# EAGLE design IEEE_EXT_Base (EAGLE 9.5.2)
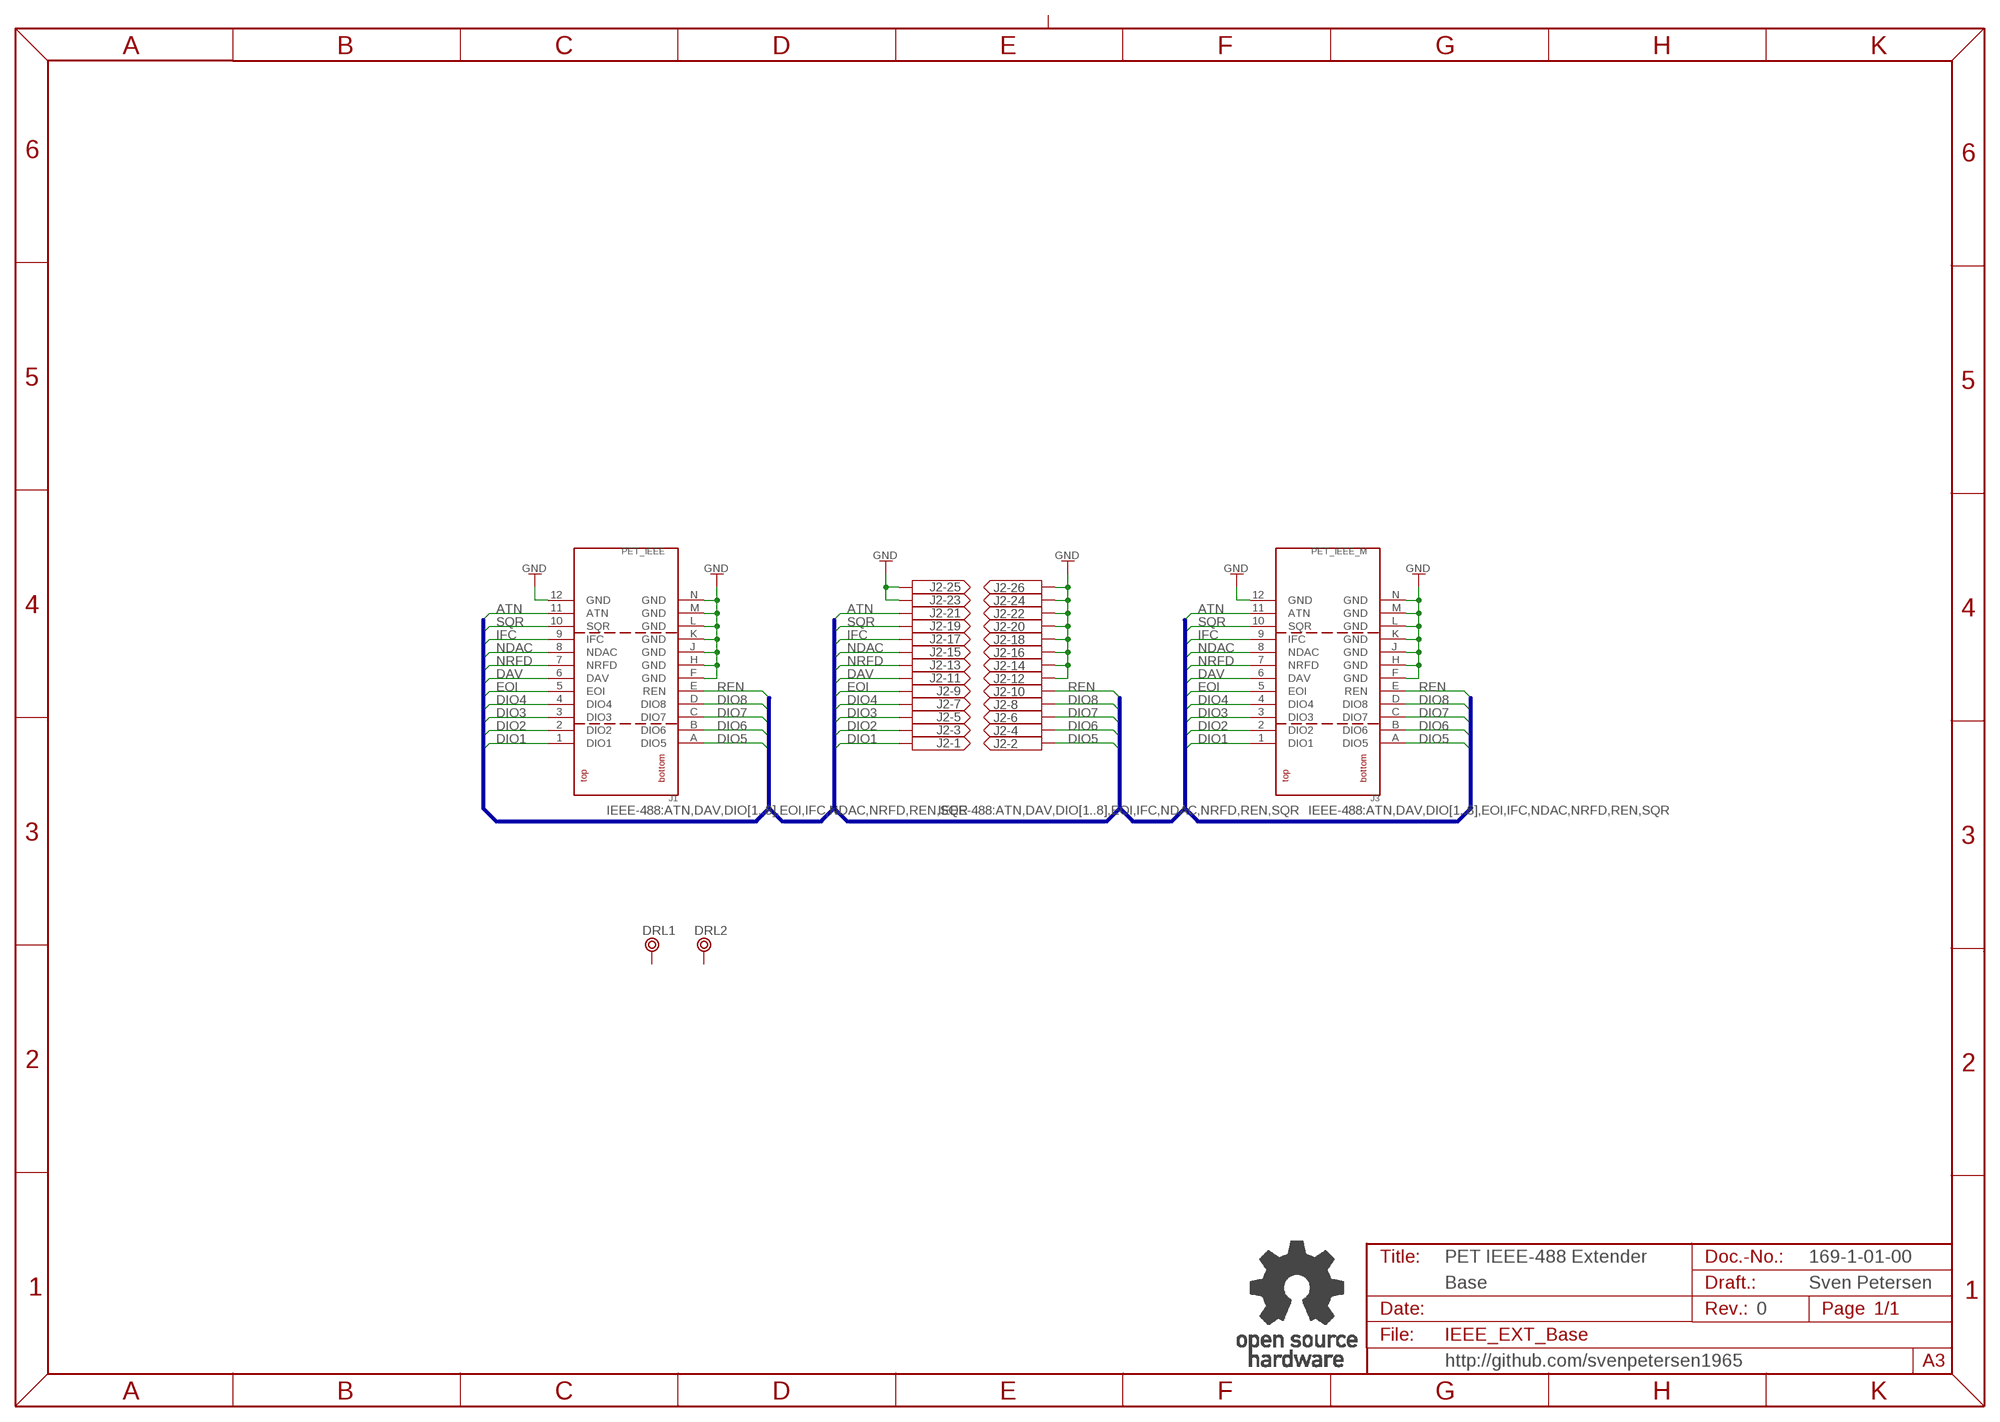
[diagram p0: schematic, sheet 1]

## Parts
DRL1  BOHR3,5  [BOHR3,5]
DRL2  BOHR3,5  [BOHR3,5]
J1  PET_IEEE  [USERPORT]
J2  2X13WANNE  [2X13WV]
J3  PET_IEEE_M  [PET_IEEE_M]
U$9  OPEN_SOURCE_HW  [OPENHW]

## Nets
ATN: J1.11(ATN) J2.21 J3.11(ATN)
DAV: J1.6(DAV) J2.11 J3.6(DAV)
DIO1: J1.1(DIO1) J2.1 J3.1(DIO1)
DIO2: J1.2(DIO2) J2.3 J3.2(DIO2)
DIO3: J1.3(DIO3) J2.5 J3.3(DIO3)
DIO4: J1.4(DIO4) J2.7 J3.4(DIO4)
DIO5: J1.A(DIO5) J2.2 J3.A(DIO5)
DIO6: J1.B(DIO6) J2.4 J3.B(DIO6)
DIO7: J1.C(DIO7) J2.6 J3.C(DIO7)
DIO8: J1.D(DIO8) J2.8 J3.D(DIO8)
EOI: J1.5(EOI) J2.9 J3.5(EOI)
GND: J1.12(GND) J1.F(GND) J1.H(GND) J1.J(GND) J1.K(GND) J1.L(GND) J1.M(GND) J1.N(GND) J2.12 J2.14 J2.16 J2.18 J2.20 J2.22 J2.23 J2.24 J2.25 J2.26 J3.12(GND) J3.F(GND) J3.H(GND) J3.J(GND) J3.K(GND) J3.L(GND) J3.M(GND) J3.N(GND)
IFC: J1.9(IFC) J2.17 J3.9(IFC)
NDAC: J1.8(NDAC) J2.15 J3.8(NDAC)
NRFD: J1.7(NRFD) J2.13 J3.7(NRFD)
REN: J1.E(REN) J2.10 J3.E(REN)
SQR: J1.10(SQR) J2.19 J3.10(SQR)
Unconnected: DRL1.P$1 DRL2.P$1

## Buses
IEEE-488:ATN,DAV,DIO[1..8],EOI,IFC,NDAC,NRFD,REN,SQR

## Notes on the sheet
- PET IEEE-488 Extender | 169-1-01-00
- Base | Sven Petersen
- 0
- http://github.com/svenpetersen1965

## Library data of the parts
DRL1 DRL2 = Mech_Bohr:BOHR3,5
J1 J3 = Commodore:PET_IEEE
J2 = PINHEAD:2X13WANNE
U$9 = Logo:OPEN_SOURCE_HW

## Board
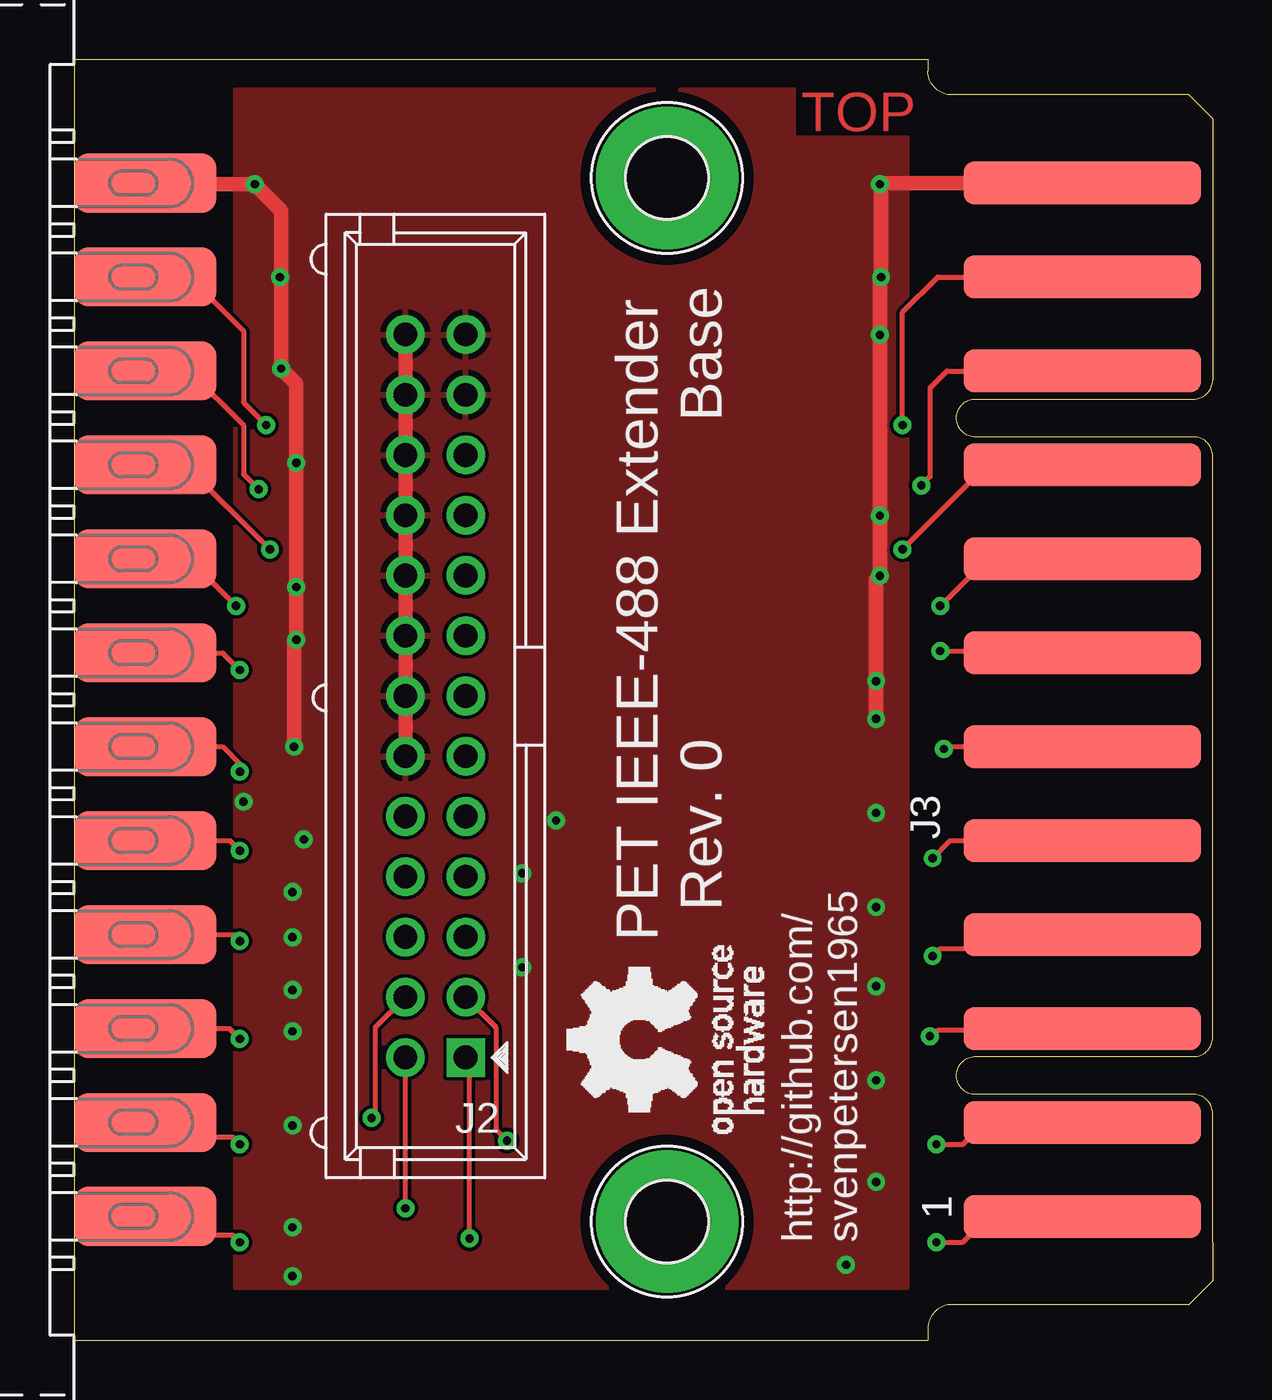
[diagram p1: board, top side]
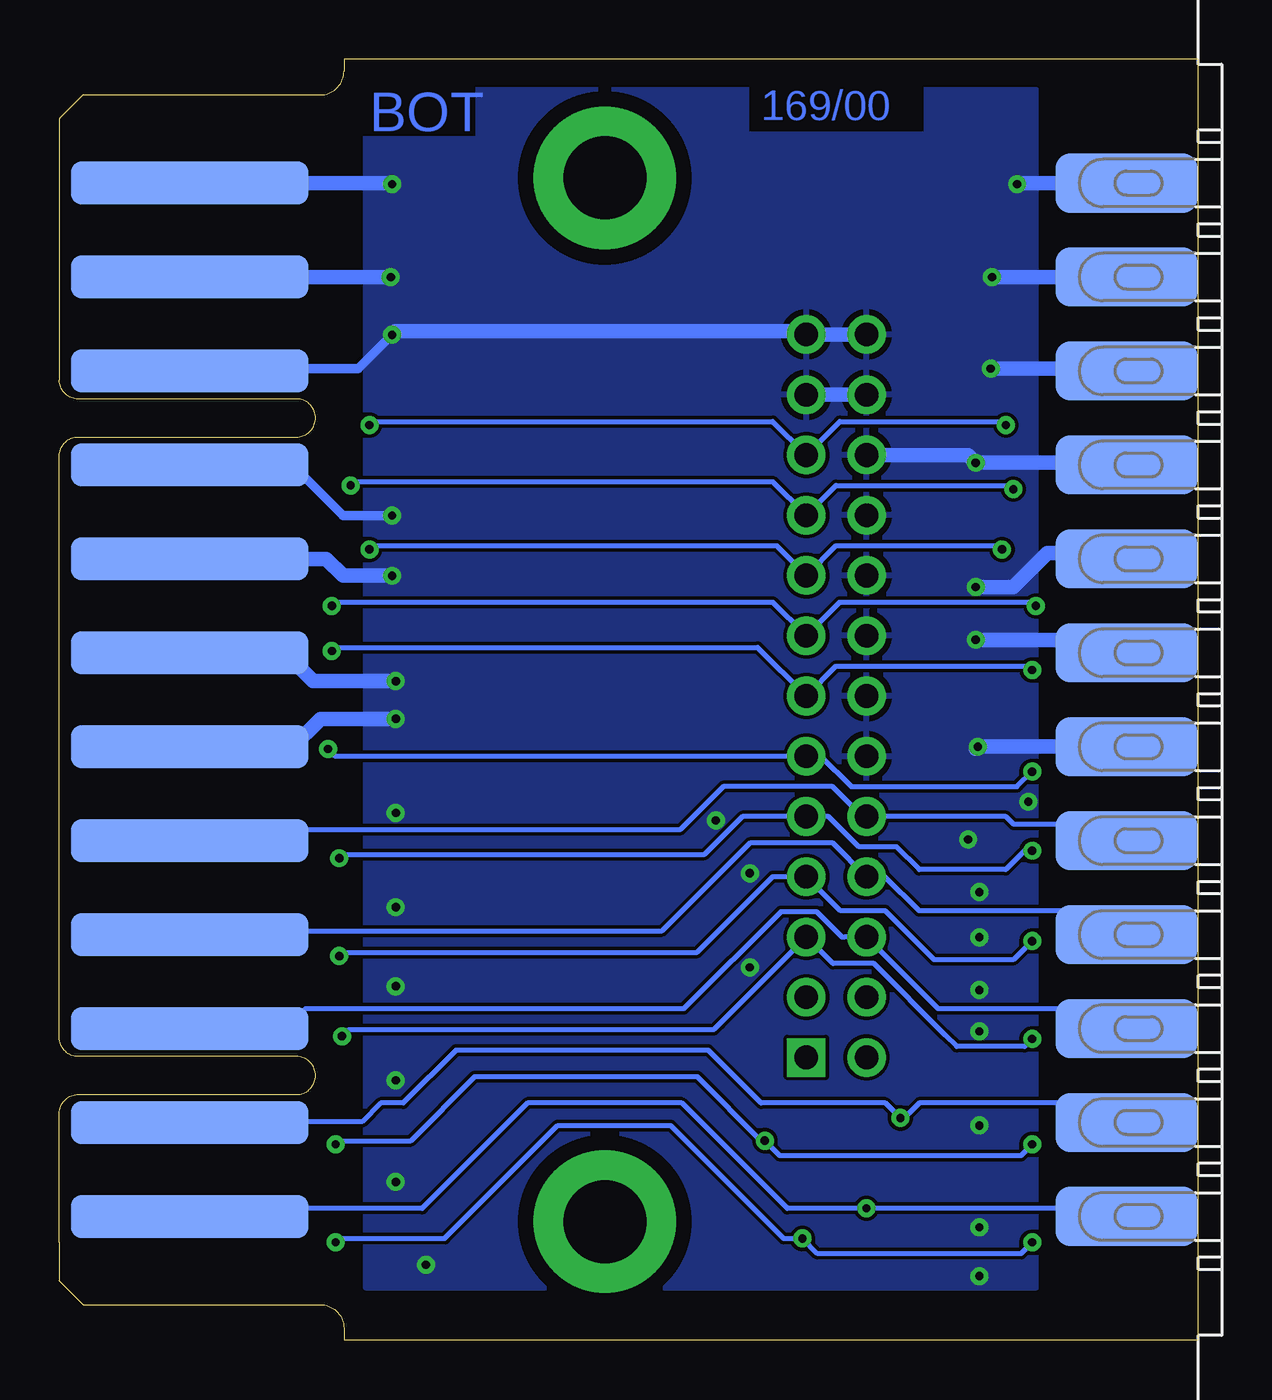
[diagram p2: board, bottom side, seen from below]

Size 48 x 54 mm. Coordinates in mm from the lower left corner, seen from the top.
Outline: 36,53.5 36,54 0,54 0,0 36,0 36,0.5
Copper layers (1*16): Top 0.035mm / dielectric 1.5mm / Bottom 0.035mm
Design rules "default *": minimum track width 6mil, minimum drill 0.35mm, track to track 6mil, track to pad 6mil, pad to pad 6mil, via to via 6mil, smd to smd 6mil, copper to edge 40mil, drill to drill 6mil, minimum pad ring 10mil, minimum via ring 8mil, stop-mask expansion 4mil, vias tented up to drill 25mil, thermal gap 10mil
bRestrict: 3 lines

### Footprints (pad centres in the part's own frame; a part is rotated, then mirrored left to right if it is on the bottom)
BOHR3,5 = drill 3.5 pad 6: P$1 0,0
USERPORT = smd 2.5 x 6: 1 -21.78,-3; 2 -17.82,-3; 3 -13.86,-3; 4 -9.9,-3; 5 -5.94,-3; 6 -1.98,-3; 7 1.98,-3; 8 5.94,-3; 9 9.9,-3; 10 13.86,-3; 11 17.82,-3; 12 21.78,-3 | smd 2.5 x 6 bottom: A -21.78,-3; B -17.82,-3; C -13.86,-3; D -9.9,-3; E -5.94,-3; F -1.98,-3; H 1.98,-3; J 5.94,-3; K 9.9,-3; L 13.86,-3; M 17.82,-3; N 21.78,-3
2X13WV = drill 1 pad 1.626 square: 1 -15.24,-1.27 | drill 1 pad 1.626: 2 -15.24,1.27; 3 -12.7,-1.27; 4 -12.7,1.27; 5 -10.16,-1.27; 6 -10.16,1.27; 7 -7.62,-1.27; 8 -7.62,1.27; 9 -5.08,-1.27; 10 -5.08,1.27; 11 -2.54,-1.27; 12 -2.54,1.27; 13 0,-1.27; 14 0,1.27; 15 2.54,-1.27; 16 2.54,1.27; 17 5.08,-1.27; 18 5.08,1.27; 19 7.62,-1.27; 20 7.62,1.27; 21 10.16,-1.27; 22 10.16,1.27; 23 12.7,-1.27; 24 12.7,1.27; 25 15.24,-1.27; 26 15.24,1.27
PET_IEEE_M = smd 1.8 x 10: 1 -21.78,5.5; 2 -17.82,5.5; 3 -13.86,5.5; 4 -9.9,5.5; 5 -5.94,5.5; 6 -1.98,5.5; 7 1.98,5.5; 8 5.94,5.5; 9 9.9,5.5; 10 13.86,5.5; 11 17.82,5.5; 12 21.78,5.5 | smd 1.8 x 10 bottom: A -21.78,5.5; B -17.82,5.5; C -13.86,5.5; D -9.9,5.5; E -5.94,5.5; F -1.98,5.5; H 1.98,5.5; J 5.94,5.5; K 9.9,5.5; L 13.86,5.5; M 17.82,5.5; N 21.78,5.5

### Placement (x,y rotation side)
DRL1  25,5 0 top
DRL2  25,49 0 top
J1  0,27 90 top
J2  15.24,27.16 90 top
J3  48,27 90 top
U$8  [PCB-TITLE/]  0,68.42 0 top  (outside the outline)
U$9  29.05,8.73 90 top
U$10  [2LAYER]  30.64,50.96 0 top

### Tracks (layer width: path | path; a pad name or v marks a point on that pad's centre or on a via)
ATN  (via drill 0.35)
  Top 0.203: J1.11 4.87,44.82 7.14,42.55 7.14,39.53 v8.1,38.58 | v34.92,38.58 34.92,43.34 36.41,44.82 J3.11
  Bottom 0.203: v8.1,38.58 8.26,38.73 15.09,38.73 J2.21 17.92,38.73 34.77,38.73 v34.92,38.58
DAV  (via drill 0.35)
  Top 0.203: J1.6 6.25,25.02 6.99,24.29 v6.99,23.97 | v36.67,24.92 36.77,25.02 J3.6
  Bottom 0.203: v6.99,23.97 7.62,23.34 14.61,23.34 15.89,24.62 J2.11 36.37,24.62 v36.67,24.92
DIO1  (via drill 0.35)
  Top 0.203: J1.1 3.79,4.43 6.69,4.43 v6.99,4.13 | v36.35,4.13 37.47,4.13 38.56,5.22 J3.1 | v16.67,4.29 16.67,11.76 J2.1
  Bottom 0.203: v6.99,4.13 7.46,3.65 16.03,3.65 v16.67,4.29 17.46,4.29 22.23,9.05 26.99,9.05 31.75,4.29 36.2,4.29 v36.35,4.13
DIO2  (via drill 0.35)
  Top 0.203: J1.2 3,8.75 3.17,8.57 6.67,8.57 v6.99,8.26 | v18.26,8.41 17.78,8.89 17.78,13.19 J2.3 | v36.35,8.26 37.47,8.26 38.39,9.18 J3.2
  Bottom 0.203: v6.99,8.26 7.46,7.78 17.62,7.78 v18.26,8.41 18.41,8.41 21.11,11.11 30.48,11.11 33.18,8.41 36.2,8.41 v36.35,8.26
DIO3  (via drill 0.35)
  Top 0.203: J1.3 6.54,13.14 v6.99,12.7 | J3.3 42.44,13.08 36.42,13.08 36.16,12.81 v36.08,12.81
  Bottom 0.203: v6.99,12.7 7.3,12.38 10.16,12.38 10.64,12.86 13.65,15.88 15.38,15.88 J2.5 20.16,13.35 20.16,13.34 20.4,13.09 35.8,13.09 v36.08,12.81
DIO4  (via drill 0.35)
  Top 0.203: J1.4 6.71,17.1 v6.99,16.83 | v36.2,16.19 36.51,16.51 42.23,16.51 42.5,16.78 J3.4
  Bottom 0.203: v6.99,16.83 7.78,16.03 11.11,16.03 12.06,16.99 13.18,18.1 15.07,18.1 J2.7 17.93,19.54 21.11,16.35 36.04,16.35 v36.2,16.19
DIO5  (via drill 0.35)
  Top 0.203: v13.97,5.56 J2.2
  Bottom 0.203: J1.A 3.34,5.56 v13.97,5.56 17.3,5.56 21.75,10 28.26,10 32.7,5.56 42.16,5.56 J3.A
DIO6  (via drill 0.35)
  Top 0.203: v12.54,9.37 12.7,9.53 12.7,13.19 J2.4
  Bottom 0.203: J1.B 3.02,9.21 3.81,10 11.75,10 12.41,9.34 12.51,9.34 v12.54,9.37 13.18,10 18.41,10 20.64,12.22 31.27,12.22 33.5,10 34.45,10 35.24,9.21 42.47,9.21 J3.B
DIO7
  Bottom 0.203: J1.C 3.83,13.97 10.94,13.97 J2.6 14.91,17 14.92,16.99 14.99,16.99 16.07,18.07 17.58,18.07 21.68,13.97 37.62,13.97 38.45,13.14 J3.C
DIO8
  Bottom 0.203: J1.D 4.72,17.1 5.71,18.1 11.75,18.1 13.19,19.54 J2.8 15.38,20.95 18.89,20.95 22.59,17.26 42.34,17.26 J3.D
EOI  (via drill 0.35)
  Top 0.203: J1.5 6.56,21.06 v6.99,20.64 | v36.2,20.32 36.94,21.06 J3.5
  Bottom 0.203: v6.99,20.64 7.3,20.64 8.1,19.84 11.75,19.84 12.7,20.8 14.29,20.8 15.57,22.08 J2.9 19.2,22.08 20.8,20.48 36.04,20.48 v36.2,20.32
GND  (via drill 0.35)
  Top 0.61: J2.12 J2.14 J2.16 J2.18 J2.20 J2.22 J2.24 J2.26 | J1.N 3.04,48.74 v7.62,48.74 8.73,47.62 8.73,44.77 | 8.73,44.77 v8.68,44.82 | 8.73,44.77 v8.73,40.96 9.37,40.32 v9.37,36.99 v9.37,31.75 v9.37,29.53 9.27,29.43 v9.27,25.02 | J3.N 34.02,48.78 | 34.02,48.78 v33.97,48.74 | v33.81,26.19 v33.81,27.78 33.81,32.07 v33.97,32.23 v33.97,34.77 v33.97,42.39 33.97,44.77 v34.02,44.82 v34.02,44.83 34.02,48.78
  Bottom 0.406: J3.F 38.99,25.02 38.89,24.92 38.26,24.92 | J3.K 38.17,36.9 36.04,34.77 v33.97,34.77 | J3.L 42.4,40.96 35.4,40.96 v33.97,42.39 | v34.02,44.82 33.97,44.77
  Bottom 0.61: v33.81,26.19 36.99,26.19 38.26,24.92 | J2.24 J2.23 | J2.26 J2.25 16.65,42.55 33.81,42.55 v33.97,42.39 | J1.N 7.58,48.78 v7.62,48.74 | J1.M v8.68,44.82 8.73,44.77 | J1.L 3.1,40.96 v8.73,40.96 | J1.K 3.09,36.99 v9.37,36.99 9.7,37.32 J2.22 | J1.J 3.24,33.18 6.35,33.18 7.78,31.75 v9.37,31.75 | J1.H 3.55,29.53 v9.37,29.53 | J1.F v9.27,25.02 9.37,24.92 | J3.H 38.65,28.98 38.58,29.05 37.31,27.78 v33.81,27.78 | J3.J 36.75,32.94 36.04,32.23 v33.97,32.23 | J3.M v34.02,44.82 | J3.N 34.02,48.78 v33.97,48.74
  other vias: 33.81,22.23 33.81,18.26 33.81,14.92 33.81,10.95 33.81,6.67 32.54,3.17 9.21,14.76 9.21,18.89 7.14,22.7 9.68,21.11 9.21,16.99 9.21,13.02 9.21,9.05 9.21,4.76 18.89,15.72 18.89,19.68 20.32,21.91 9.21,2.7
  pour Top: 6.83,52.7 35.08,52.7 35.08,2.22 6.83,2.22
  pour Bottom: 6.83,52.7 35.08,52.7 35.08,2.22 6.83,2.22
IFC  (via drill 0.35)
  Top 0.203: J1.9 4.69,36.9 v8.26,33.34 | v34.92,33.34 38.49,36.9 J3.9
  Bottom 0.203: v8.26,33.34 8.41,33.5 15.25,33.5 J2.17 17.77,33.5 34.77,33.5 v34.92,33.34
NDAC  (via drill 0.35)
  Top 0.203: J1.8 4.84,32.94 v6.83,30.96 | v36.51,30.96 38.5,32.94 J3.8
  Bottom 0.203: v6.83,30.96 6.99,31.11 15.09,31.11 J2.15 17.92,31.11 36.35,31.11 v36.51,30.96
NRFD  (via drill 0.35)
  Top 0.203: J1.7 6.26,28.98 v6.99,28.26 | v36.51,29.05 42.43,29.05 J3.7
  Bottom 0.203: v6.99,28.26 7.14,28.42 15.25,28.42 J2.13 18.56,29.21 36.35,29.21 v36.51,29.05
REN
  Bottom 0.203: J1.E 4.87,21.06 5.57,21.76 7.78,21.76 8.09,22.08 J2.10 14.14,22.08 15.4,23.34 20,23.34 21.8,21.54 42.02,21.54 J3.E
SQR  (via drill 0.35)
  Top 0.203: J1.10 4.86,40.86 7.14,38.58 7.14,36.51 v7.78,35.88 | v35.72,36.04 36.08,36.4 36.08,40.14 36.8,40.86 J3.10
  Bottom 0.203: v7.78,35.88 7.94,36.04 15.25,36.04 J2.19 17.92,36.2 35.56,36.2 v35.72,36.04

### Text on the board
Bottom: 169/00
tPlace: Base | Rev. 0 | PET IEEE-488 Extender | http://github.com/ / svenpetersen1965
Document: 169-2-01-00 | Sven Petersen / 2020 | 35µm | 2 | 0